# Altium schematic sheet Overall Design.SchDoc
size 325 x 299 mm; SheetNumber: 1; SheetTotal: 7
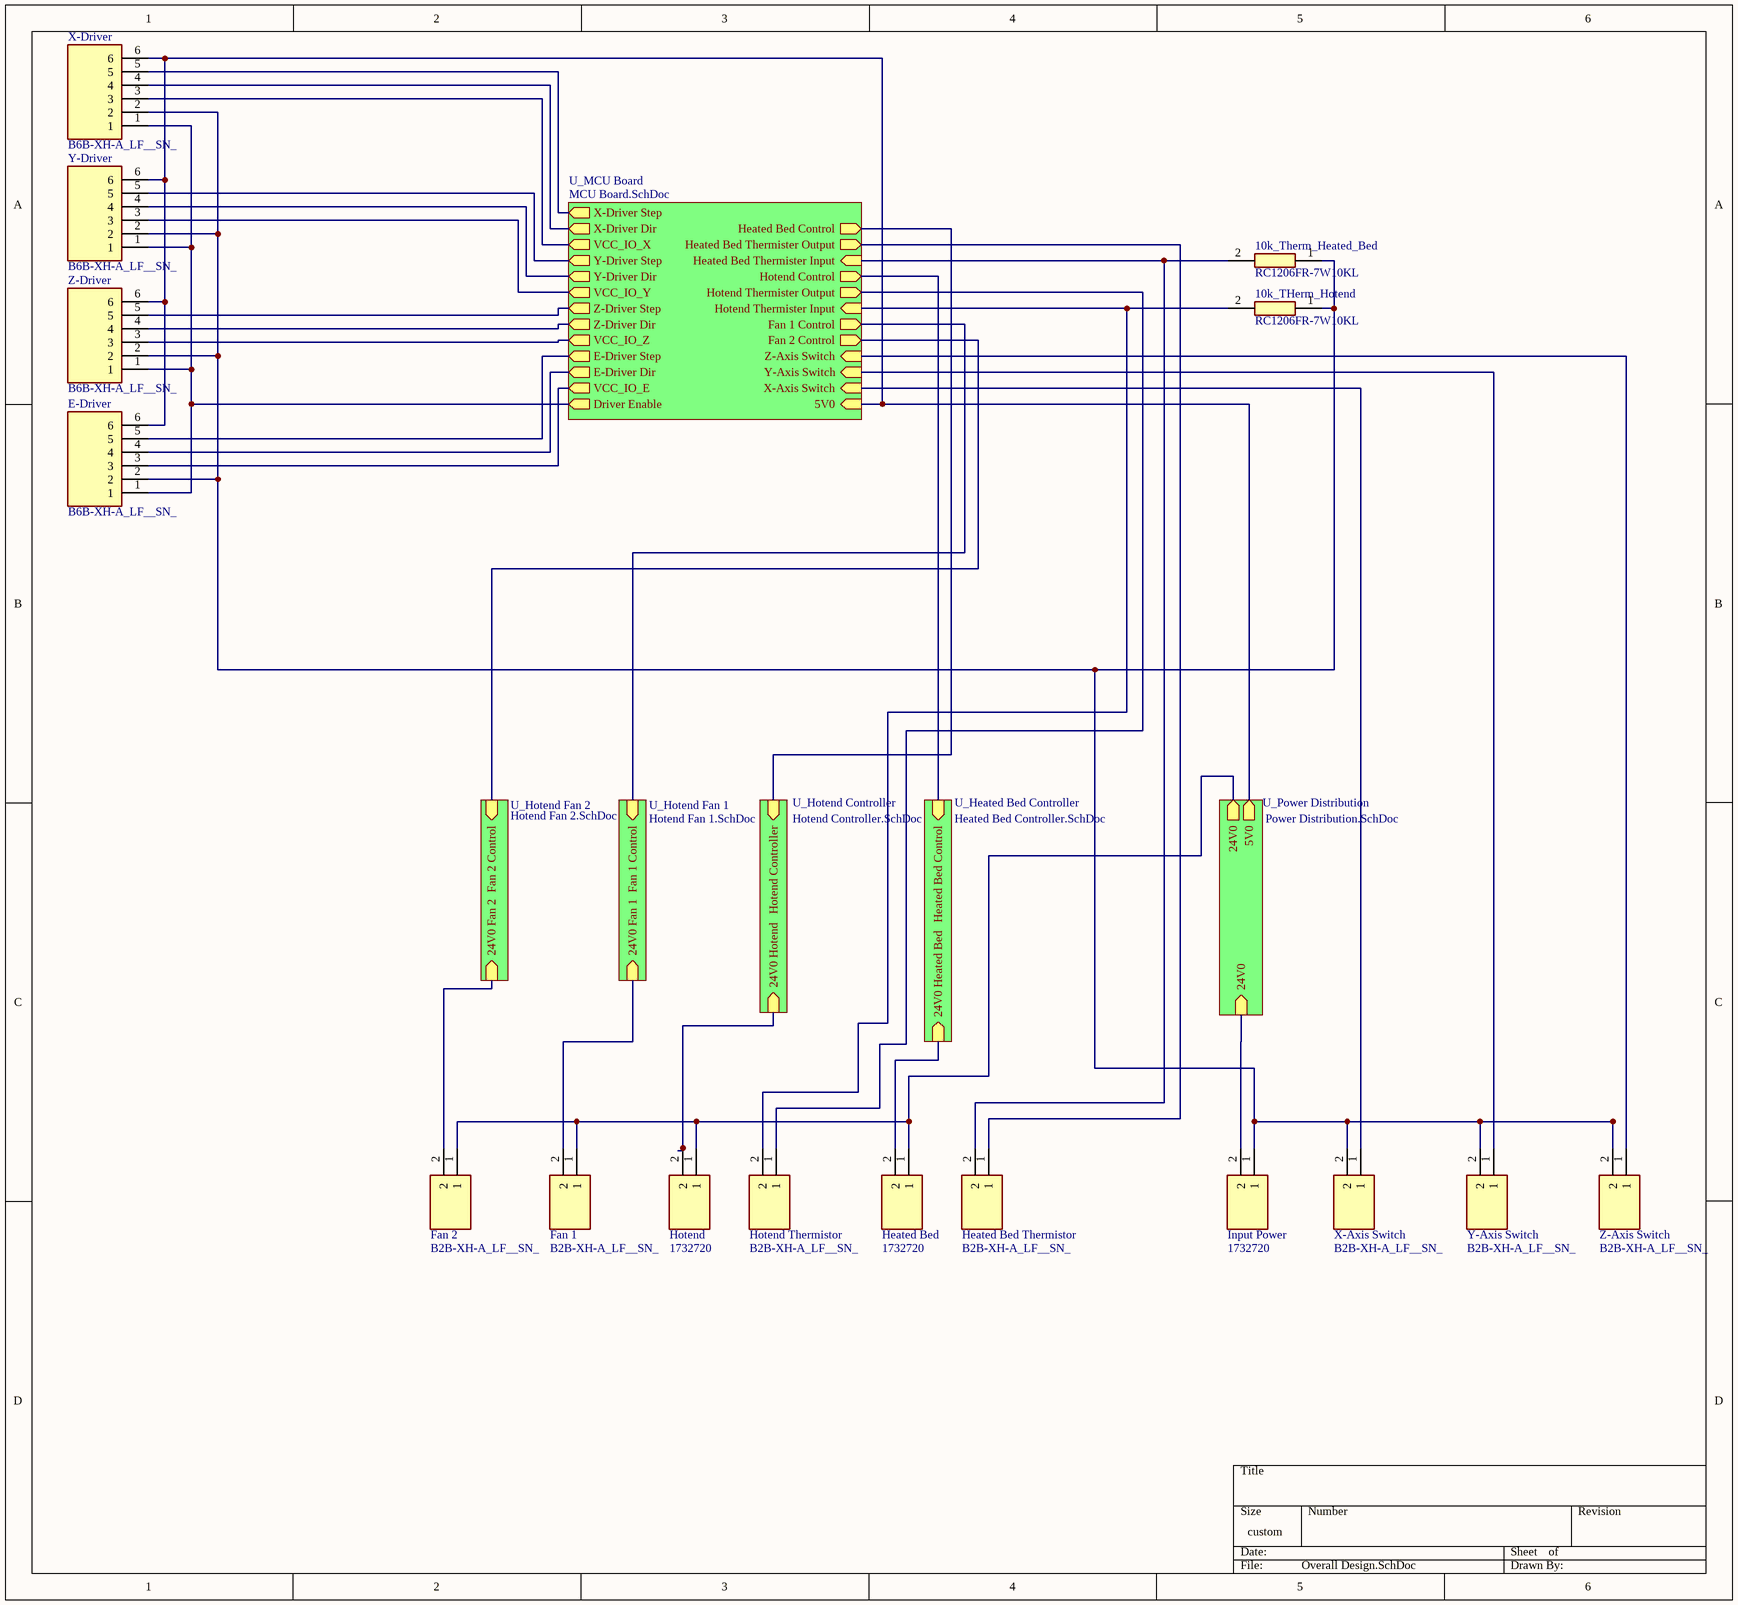
[diagram p0: Overall Design.SchDoc]

## Parts
10k_Therm_Heated_Bed  RC1206FR-7W10KL  [RESC3116X65N]
10k_THerm_Hotend  RC1206FR-7W10KL  [RESC3116X65N]
E-Driver  B6B-XH-A_LF__SN_  [SHDR6W64P0X250_1X6_1740X575X700P]
Fan_1  B2B-XH-A_LF__SN_  [SHDR2W64P0X250_1X2_740X575X700P]
Fan_2  B2B-XH-A_LF__SN_  [SHDR2W64P0X250_1X2_740X575X700P]
Heated_Bed  1732720  [1732720]
Heated_Bed_Thermistor  B2B-XH-A_LF__SN_  [SHDR2W64P0X250_1X2_740X575X700P]
Hotend  1732720  [1732720]
Hotend_Thermistor  B2B-XH-A_LF__SN_  [SHDR2W64P0X250_1X2_740X575X700P]
Input_Power  1732720  [1732720]
X-Axis_Switch  B2B-XH-A_LF__SN_  [SHDR2W64P0X250_1X2_740X575X700P]
X-Driver  B6B-XH-A_LF__SN_  [SHDR6W64P0X250_1X6_1740X575X700P]
Y-Axis_Switch  B2B-XH-A_LF__SN_  [SHDR2W64P0X250_1X2_740X575X700P]
Y-Driver  B6B-XH-A_LF__SN_  [SHDR6W64P0X250_1X6_1740X575X700P]
Z-Axis_Switch  B2B-XH-A_LF__SN_  [SHDR2W64P0X250_1X2_740X575X700P]
Z-Driver  B6B-XH-A_LF__SN_  [SHDR6W64P0X250_1X6_1740X575X700P]

## Sub-sheets
U_Heated Bed Controller = Heated Bed Controller.SchDoc: Heated Bed Control (in), 24V0 Heated Bed (in)
U_Hotend Controller = Hotend Controller.SchDoc: Hotend Controller (in), 24V0 Hotend (in)
U_Hotend Fan 1 = Hotend Fan 1.SchDoc: Fan 1 Control (in), 24V0 Fan 1 (in)
U_Hotend Fan 2 = Hotend Fan 2.SchDoc: Fan 2 Control (in), 24V0 Fan 2 (in)
U_MCU Board = MCU Board.SchDoc: X-Driver Step (out), X-Driver Dir (out), Y-Driver Step (out), Y-Driver Dir (out), Z-Driver Step (out), Z-Driver Dir (out), E-Driver Step (out), E-Driver Dir (out), 5V0 (in), VCC_IO_X (out), VCC_IO_Z (out), VCC_IO_Y (out), VCC_IO_E (out), X-Axis Switch (in), Y-Axis Switch (in), Z-Axis Switch (in), Driver Enable (out), Heated Bed Control (out), Heated Bed Thermister Output (out), Hotend Control (out), Hotend Thermister Output (out), Heated Bed Thermister Input (in), Hotend Thermister Input (in), Fan 1 Control (out), Fan 2 Control (out)
U_Power Distribution = Power Distribution.SchDoc: 5V0 (out), 24V0 (out), 24V0 (in)

## Nets
Net10k_Therm_Heated_Bed_1: 10k_Therm_Heated_Bed.1 10k_THerm_Hotend.1 E-Driver.2 Input_Power.1 X-Axis_Switch.2 X-Driver.2 Y-Axis_Switch.2 Y-Driver.2 Z-Axis_Switch.2 Z-Driver.2
Net10k_Therm_Heated_Bed_2: 10k_Therm_Heated_Bed.2 Heated_Bed_Thermistor.2 ; sheet U_MCU Board/Heated Bed Thermister Input
Net10k_THerm_Hotend_2: 10k_THerm_Hotend.2 Hotend_Thermistor.2 ; sheet U_MCU Board/Hotend Thermister Input
NetE-Driver_1: E-Driver.1 X-Driver.1 Y-Driver.1 Z-Driver.1 ; sheet U_MCU Board/Driver Enable
NetE-Driver_3: E-Driver.3 ; sheet U_MCU Board/VCC_IO_E
NetE-Driver_4: E-Driver.4 ; sheet U_MCU Board/E-Driver Dir
NetE-Driver_5: E-Driver.5 ; sheet U_MCU Board/E-Driver Step
NetE-Driver_6: E-Driver.6 X-Driver.6 Y-Driver.6 Z-Driver.6 ; sheet U_Power Distribution/5V0, sheet U_MCU Board/5V0
NetFan_1_1: Fan_1.1 Fan_2.1 Heated_Bed.1 Hotend.1 ; sheet U_Power Distribution/24V0
NetFan_1_2: Fan_1.2 ; sheet U_Hotend Fan 1/24V0 Fan 1
NetFan_2_2: Fan_2.2 ; sheet U_Hotend Fan 2/24V0 Fan 2
NetHeated_Bed_2: Heated_Bed.2 ; sheet U_Heated Bed Controller/24V0 Heated Bed
NetHeated_Bed_Thermistor_1: Heated_Bed_Thermistor.1 ; sheet U_MCU Board/Heated Bed Thermister Output
NetHotend_2: Hotend.2 ; sheet U_Hotend Controller/24V0 Hotend
NetHotend_Thermistor_1: Hotend_Thermistor.1 ; sheet U_MCU Board/Hotend Thermister Output
NetInput_Power_2: Input_Power.2 ; sheet U_Power Distribution/24V0
NetX-Axis_Switch_1: X-Axis_Switch.1 ; sheet U_MCU Board/X-Axis Switch
NetX-Driver_3: X-Driver.3 ; sheet U_MCU Board/VCC_IO_X
NetX-Driver_4: X-Driver.4 ; sheet U_MCU Board/X-Driver Dir
NetX-Driver_5: X-Driver.5 ; sheet U_MCU Board/X-Driver Step
NetY-Axis_Switch_1: Y-Axis_Switch.1 ; sheet U_MCU Board/Y-Axis Switch
NetY-Driver_3: Y-Driver.3 ; sheet U_MCU Board/VCC_IO_Y
NetY-Driver_4: Y-Driver.4 ; sheet U_MCU Board/Y-Driver Dir
NetY-Driver_5: Y-Driver.5 ; sheet U_MCU Board/Y-Driver Step
NetZ-Axis_Switch_1: Z-Axis_Switch.1 ; sheet U_MCU Board/Z-Axis Switch
NetZ-Driver_3: Z-Driver.3 ; sheet U_MCU Board/VCC_IO_Z
NetZ-Driver_4: Z-Driver.4 ; sheet U_MCU Board/Z-Driver Dir
NetZ-Driver_5: Z-Driver.5 ; sheet U_MCU Board/Z-Driver Step
(unnamed): sheet U_Hotend Fan 2/Fan 2 Control, sheet U_MCU Board/Fan 2 Control
(unnamed): sheet U_Hotend Fan 1/Fan 1 Control, sheet U_MCU Board/Fan 1 Control
(unnamed): sheet U_Hotend Controller/Hotend Controller, sheet U_MCU Board/Heated Bed Control
(unnamed): sheet U_Heated Bed Controller/Heated Bed Control, sheet U_MCU Board/Hotend Control

## Library data of the parts
10k_Therm_Heated_Bed 10k_THerm_Hotend = RC1206FR-7W10KL: Resistor; Manufacturer_Name: KEMET; Datasheet Link: https://datasheet.datasheetarchive.com/originals/distributors/Datasheets_SAMA/902f9e387b938f871d31120f5fc1d65e.pdf; Height: 0.65mm; Manufacturer_Part_Number: RC1206FR-7W10KL; Arrow Part Number: RC1206FR-7W10KL; Arrow Price/Stock: https://www.arrow.com/en/products/rc1206fr-7w10kl/yageo
E-Driver X-Driver Y-Driver Z-Driver = B6B-XH-A_LF__SN_: Connector; Manufacturer_Name: JST (JAPAN SOLDERLESS TERMINALS); Manufacturer_Part_Number: B6B-XH-A(LF)(SN); Datasheet Link: https://datasheet.lcsc.com/szlcsc/JST-Sales-America-B6B-XH-A-LF-SN_C144397.pdf; Height: 7mm; Arrow Part Number: B6B-XH-A(LF)(SN); Arrow Price/Stock: https://www.arrow.com/en/products/b6b-xh-a-lf-sn/jst-manufacturing?region=europe
Fan_1 Fan_2 Heated_Bed_Thermistor Hotend_Thermistor X-Axis_Switch Y-Axis_Switch Z-Axis_Switch = B2B-XH-A_LF__SN_: Connector; Manufacturer_Name: JST (JAPAN SOLDERLESS TERMINALS); Manufacturer_Part_Number: B2B-XH-A(LF)(SN); Datasheet Link: http://www.jst-mfg.com/product/pdf/eng/eXH.pdf; Height: 7mm; Arrow Part Number: B2B-XH-A(LF)(SN); Arrow Price/Stock: https://www.arrow.com/en/products/b2b-xh-a-lf-sn/jst-manufacturing?region=europe
Heated_Bed Hotend Input_Power = 1732720: Connector; Manufacturer_Name: Phoenix Contact; Datasheet Link: https://media.digikey.com/pdf/Data%20Sheets/Phoenix%20Contact%20PDFs/1732720.pdf; Height: 18mm; Manufacturer_Part_Number: 1732720; Mouser Part Number: 651-1732720; Mouser Price/Stock: https://www.mouser.co.uk/ProductDetail/Phoenix-Contact/1732720?qs=DAHzmYU9cu2maJEX8AM1Kg%3D%3D; Arrow Part Number: 1732720; Arrow Price/Stock: https://www.arrow.com/en/products/1732720/phoenix-contact